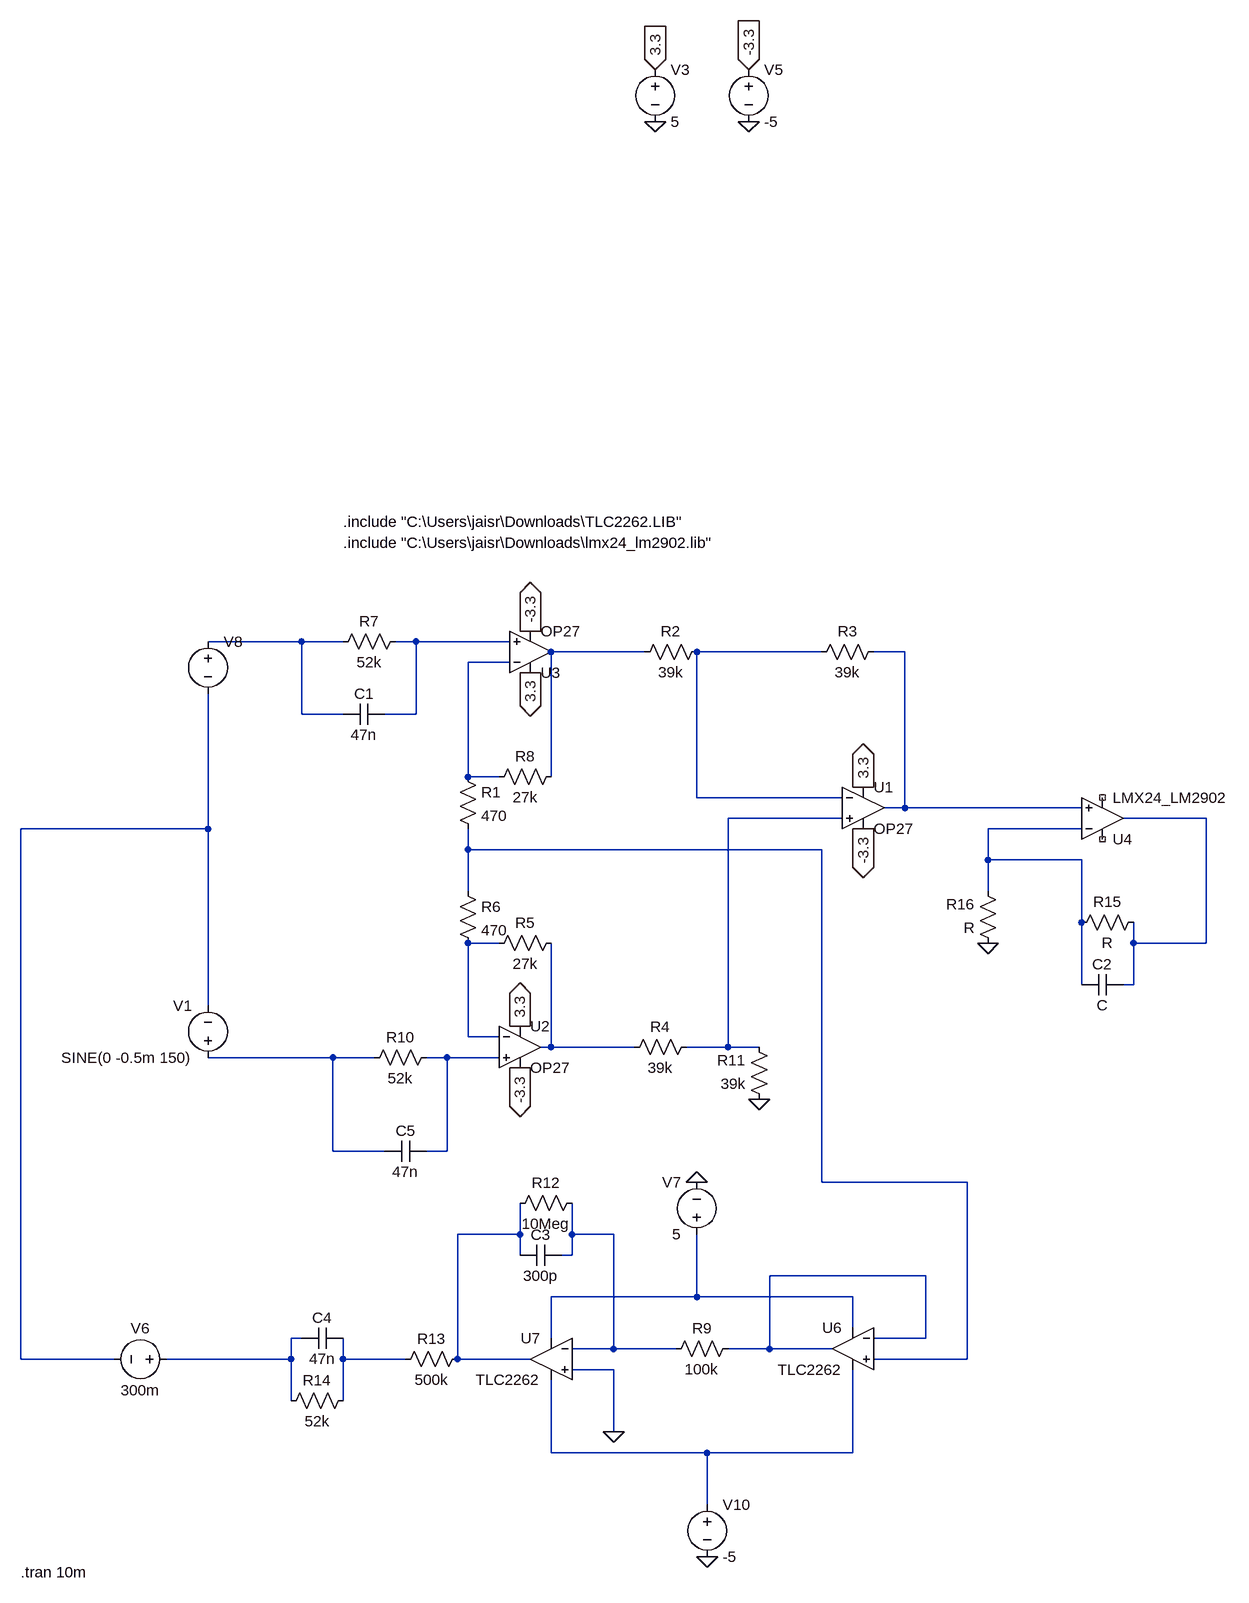
[diagram p0: schematic IA+RLD.asc]
IA+RLD.asc, the LTspice schematic file:
Version 4.1
SHEET 1 1876 936
WIRE -768 -512 -912 -512
WIRE -704 -512 -768 -512
WIRE -592 -512 -624 -512
WIRE -448 -512 -592 -512
WIRE -240 -496 -384 -496
WIRE 32 -496 -160 -496
WIRE 160 -496 112 -496
WIRE -448 -480 -512 -480
WIRE -768 -400 -768 -512
WIRE -704 -400 -768 -400
WIRE -592 -400 -592 -512
WIRE -592 -400 -640 -400
WIRE -512 -304 -512 -480
WIRE -464 -304 -512 -304
WIRE -384 -304 -384 -496
WIRE -160 -272 -160 -496
WIRE 64 -272 -160 -272
WIRE 160 -256 160 -496
WIRE 160 -256 128 -256
WIRE 432 -256 160 -256
WIRE 64 -240 -112 -240
WIRE 624 -240 496 -240
WIRE -912 -224 -912 -432
WIRE -912 -224 -1200 -224
WIRE 432 -224 288 -224
WIRE -512 -192 -512 -224
WIRE 32 -192 -512 -192
WIRE 288 -176 288 -224
WIRE 432 -176 288 -176
WIRE -512 -128 -512 -192
WIRE 288 -128 288 -176
WIRE 432 -80 432 -176
WIRE -464 -48 -512 -48
WIRE 512 -48 512 -80
WIRE 624 -48 624 -240
WIRE 624 -48 512 -48
WIRE 432 16 432 -80
WIRE 512 16 512 -48
WIRE 512 16 496 16
WIRE -912 48 -912 -224
WIRE -512 96 -512 -48
WIRE -464 96 -512 96
WIRE -384 112 -384 -48
WIRE -384 112 -400 112
WIRE -256 112 -384 112
WIRE -112 112 -112 -240
WIRE -112 112 -176 112
WIRE -64 112 -112 112
WIRE -720 128 -912 128
WIRE -656 128 -720 128
WIRE -544 128 -576 128
WIRE -464 128 -544 128
WIRE -720 272 -720 128
WIRE -640 272 -720 272
WIRE -544 272 -544 128
WIRE -544 272 -576 272
WIRE 32 320 32 -192
WIRE 256 320 32 320
WIRE -432 400 -432 352
WIRE -432 400 -528 400
WIRE -352 400 -352 352
WIRE -288 400 -352 400
WIRE -432 432 -432 400
WIRE -352 432 -352 400
WIRE -352 432 -368 432
WIRE 192 464 -48 464
WIRE -160 496 -160 400
WIRE -160 496 -384 496
WIRE 80 496 -160 496
WIRE 80 544 80 496
WIRE -768 560 -784 560
WIRE -384 560 -384 496
WIRE 192 560 192 464
WIRE 192 560 112 560
WIRE -288 576 -288 400
WIRE -288 576 -352 576
WIRE -192 576 -288 576
WIRE -48 576 -48 464
WIRE -48 576 -112 576
WIRE 48 576 -48 576
WIRE -1200 592 -1200 -224
WIRE -1056 592 -1200 592
WIRE -784 592 -784 560
WIRE -784 592 -976 592
WIRE -704 592 -704 560
WIRE -608 592 -704 592
WIRE -528 592 -528 400
WIRE -416 592 -528 592
WIRE 256 592 256 320
WIRE 256 592 112 592
WIRE -288 608 -352 608
WIRE -784 656 -784 592
WIRE -704 656 -704 592
WIRE -288 704 -288 608
WIRE -384 736 -384 624
WIRE -144 736 -384 736
WIRE 80 736 80 608
WIRE 80 736 -144 736
WIRE -144 816 -144 736
FLAG -224 -1312 0
FLAG -80 -1312 0
FLAG -224 -1392 3.3
IOPIN -224 -1392 In
FLAG -80 -1392 -3.3
IOPIN -80 -1392 In
FLAG -64 192 0
FLAG -416 -464 3.3
IOPIN -416 -464 Out
FLAG -432 80 3.3
IOPIN -432 80 Out
FLAG -416 -528 -3.3
IOPIN -416 -528 Out
FLAG -432 144 -3.3
IOPIN -432 144 Out
FLAG 96 -288 3.3
IOPIN 96 -288 Out
FLAG 96 -224 -3.3
IOPIN 96 -224 Out
FLAG -288 704 0
FLAG -144 896 0
FLAG -160 320 0
FLAG 288 -48 0
SYMBOL voltage -224 -1408 R0
WINDOW 123 0 0 Left 0
WINDOW 39 0 0 Left 0
SYMATTR InstName V3
SYMATTR Value 5
SYMBOL voltage -80 -1408 R0
WINDOW 123 0 0 Left 0
WINDOW 39 0 0 Left 0
SYMATTR InstName V5
SYMATTR Value -5
SYMBOL res -144 -512 R90
WINDOW 0 0 56 VBottom 2
WINDOW 3 32 56 VTop 2
SYMATTR InstName R2
SYMATTR Value 39k
SYMBOL res 128 -512 R90
WINDOW 0 0 56 VBottom 2
WINDOW 3 32 56 VTop 2
SYMATTR InstName R3
SYMATTR Value 39k
SYMBOL res -160 96 R90
WINDOW 0 0 56 VBottom 2
WINDOW 3 32 56 VTop 2
SYMATTR InstName R4
SYMATTR Value 39k
SYMBOL res -368 -64 R90
WINDOW 0 0 56 VBottom 2
WINDOW 3 32 56 VTop 2
SYMATTR InstName R5
SYMATTR Value 27k
SYMBOL res -368 -320 R90
WINDOW 0 0 56 VBottom 2
WINDOW 3 32 56 VTop 2
SYMATTR InstName R8
SYMATTR Value 27k
SYMBOL res -48 208 R180
WINDOW 0 36 76 Left 2
WINDOW 3 36 40 Left 2
SYMATTR InstName R11
SYMATTR Value 39k
SYMBOL voltage -912 -528 R0
WINDOW 123 0 0 Left 0
WINDOW 39 0 0 Left 0
WINDOW 3 116 82 Invisible 2
SYMATTR Value SINE(0 0.5m 150)
SYMATTR InstName V8
SYMBOL OpAmps\\opamp2 80 512 M0
SYMATTR InstName U6
SYMATTR Value TLC2262
SYMBOL OpAmps\\opamp2 -384 528 M0
SYMATTR InstName U7
SYMATTR Value TLC2262
SYMBOL res -96 560 R90
WINDOW 0 0 56 VBottom 2
WINDOW 3 32 56 VTop 2
SYMATTR InstName R9
SYMATTR Value 100k
SYMBOL cap -368 416 R90
WINDOW 0 0 32 VBottom 2
WINDOW 3 32 32 VTop 2
SYMATTR InstName C3
SYMATTR Value 300p
SYMBOL res -336 336 R90
WINDOW 0 0 56 VBottom 2
WINDOW 3 32 56 VTop 2
SYMATTR InstName R12
SYMATTR Value 10Meg
SYMBOL res -512 576 R90
WINDOW 0 0 56 VBottom 2
WINDOW 3 32 56 VTop 2
SYMATTR InstName R13
SYMATTR Value 500k
SYMBOL cap -704 544 R90
WINDOW 0 0 32 VBottom 2
WINDOW 3 32 32 VTop 2
SYMATTR InstName C4
SYMATTR Value 47n
SYMBOL res -688 640 R90
WINDOW 0 0 56 VBottom 2
WINDOW 3 32 56 VTop 2
SYMATTR InstName R14
SYMATTR Value 52k
SYMBOL voltage -960 592 R90
WINDOW 0 -32 56 VBottom 2
WINDOW 3 32 56 VTop 2
WINDOW 123 0 0 Left 0
WINDOW 39 0 0 Left 0
SYMATTR InstName V6
SYMATTR Value 300m
SYMBOL voltage -160 416 R180
WINDOW 0 24 96 Left 2
WINDOW 3 24 16 Left 2
WINDOW 123 0 0 Left 0
WINDOW 39 0 0 Left 0
SYMATTR InstName V7
SYMATTR Value 5
SYMBOL voltage -144 800 R0
WINDOW 123 0 0 Left 0
WINDOW 39 0 0 Left 0
SYMATTR InstName V10
SYMATTR Value -5
SYMBOL res -528 -320 R0
SYMATTR InstName R1
SYMATTR Value 470
SYMBOL res -528 -144 R0
SYMATTR InstName R6
SYMATTR Value 470
SYMBOL OpAmps\\OP27 96 -320 R0
SYMATTR InstName U1
SYMBOL OpAmps\\OP27 -432 48 R0
SYMATTR InstName U2
SYMBOL OpAmps\\OP27 -416 -432 M180
SYMATTR InstName U3
SYMBOL res -608 -528 R90
WINDOW 0 0 56 VBottom 2
WINDOW 3 32 56 VTop 2
SYMATTR InstName R7
SYMATTR Value 52k
SYMBOL res -560 112 R90
WINDOW 0 0 56 VBottom 2
WINDOW 3 32 56 VTop 2
SYMATTR InstName R10
SYMATTR Value 52k
SYMBOL cap -640 -416 R90
WINDOW 0 0 32 VBottom 2
WINDOW 3 32 32 VTop 2
SYMATTR InstName C1
SYMATTR Value 47n
SYMBOL cap -576 256 R90
WINDOW 0 0 32 VBottom 2
WINDOW 3 32 32 VTop 2
SYMATTR InstName C5
SYMATTR Value 47n
SYMBOL voltage -912 144 R180
WINDOW 0 24 96 Left 2
WINDOW 3 24 16 Left 2
WINDOW 123 0 0 Left 0
WINDOW 39 0 0 Left 0
SYMATTR InstName V1
SYMATTR Value SINE(0 -0.5m 150)
SYMBOL OpAmps\\opamp2 464 -176 M180
SYMATTR InstName U4
SYMATTR Value LMX24_LM2902
SYMBOL res 528 -96 R90
WINDOW 0 0 56 VBottom 2
WINDOW 3 32 56 VTop 2
SYMATTR InstName R15
SYMBOL res 304 -32 R180
WINDOW 0 36 76 Left 2
WINDOW 3 36 40 Left 2
SYMATTR InstName R16
SYMBOL cap 496 0 R90
WINDOW 0 0 32 VBottom 2
WINDOW 3 32 32 VTop 2
SYMATTR InstName C2
TEXT -704 -696 Left 2 !.include "C:\\Users\\jaisr\\Downloads\\TLC2262.LIB"
TEXT -1200 920 Left 2 !.tran 10m
TEXT -704 -664 Left 2 !.include "C:\\Users\\jaisr\\Downloads\\lmx24_lm2902.lib"

The netlist it stands for:
* IA+RLD.asc
V3 3.3 0 5
V5 -3.3 0 -5
R2 N004 N003 39k
R3 N005 N004 39k
R4 N007 N013 39k
R5 N013 N012 27k
R8 N003 N006 27k
R11 0 N007 39k
V8 N001 N009 SINE(0 0.5m 150)
X§U6 N011 N018 N019 N022 N018 TLC2262  ; pins In+ In- V+ V- OUT
X§U7 0 N017 N019 N022 N016 TLC2262  ; pins In+ In- V+ V- OUT
R9 N018 N017 100k
C3 N017 N016 300p
R12 N017 N016 10Meg
R13 N016 N021 500k
C4 N021 N020 47n
R14 N021 N020 52k
V6 N020 N009 300m
V7 N019 0 5
V10 N022 0 -5
R1 N006 N011 470
R6 N011 N012 470
X§U1 N007 N004 3.3 -3.3 N005 OP27  ; pins In+ In- V+ V- OUT
X§U2 N015 N012 3.3 -3.3 N013 OP27  ; pins In+ In- V+ V- OUT
X§U3 N002 N006 3.3 -3.3 N003 OP27  ; pins In+ In- V+ V- OUT
R7 N002 N001 52k
R10 N015 N014 52k
C1 N002 N001 47n
C5 N015 N014 47n
V1 N014 N009 SINE(0 -0.5m 150)
X§U4 N005 N010 NC_01 NC_02 N008 LMX24_LM2902  ; pins In+ In- V+ V- OUT
R15 N008 N010 R
R16 0 N010 R
C2 N008 N010 C
.include "C:\Users\jaisr\Downloads\TLC2262.LIB"
.tran 10m
.include "C:\Users\jaisr\Downloads\lmx24_lm2902.lib"
.lib ADI.lib
.backanno
.end